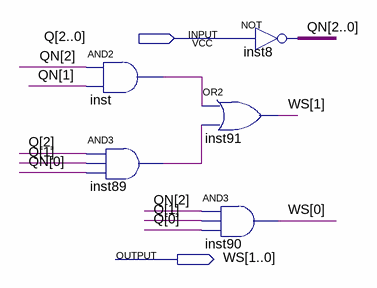
[diagram p0: schematic sheet]
// Quartus schematic WS.bdf as structural Verilog: 5 symbols, 2 pins
module WS (
  input  [2:0] Q,
  output [1:0] WS
);

  wire inst89_out, inst_out;
  wire [2:0] QN;

  and inst (inst_out, QN[2], QN[1]);
  and inst89 (inst89_out, Q[2], Q[1], QN[0]);
  or inst91 (WS[1], inst_out, inst89_out);
  and inst90 (WS[0], QN[2], Q[1], Q[0]);
  assign QN = ~Q;  // NOT inst8, 3 bits wide
endmodule
